# Altium schematic sheet LEDS_SWITCHS.SchDoc
size A; SheetNumber: 3; SheetTotal: 6
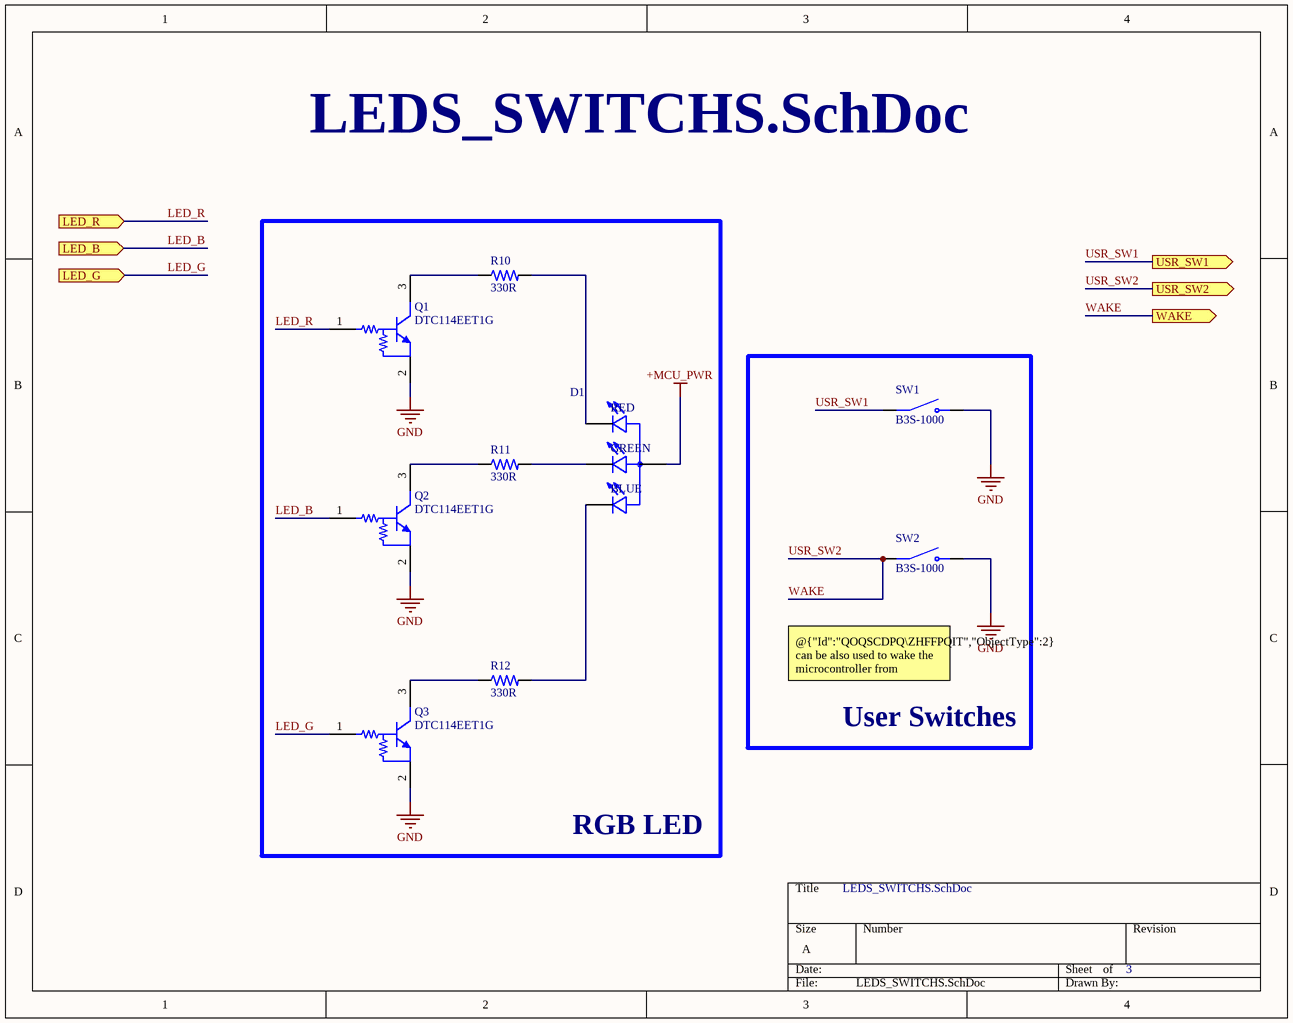
[diagram p0: LEDS_SWITCHS.SchDoc]

## Parts
D1  CLMVC-FKA-CL1D1L71BB7C3C3  [LED_CLMVC-FKA-CL1D1L71BB7C3C3]  (value not drawn)
Q1  DTC114EET1G  [ONSC-SC-75-3-463-01_V]
Q2  DTC114EET1G  [ONSC-SC-75-3-463-01_V]
Q3  DTC114EET1G  [ONSC-SC-75-3-463-01_V]
R10  330R  [0402 RES]
R11  330R  [0402 RES]
R12  330R  [0402 RES]
SW1  B3S-1000  [SW_B3S-1000]
SW2  B3S-1000  [SW_B3S-1000]

## Blocks framed on the sheet
RGB LED: D1 Q1-Q3 R10-R12
User Switches: SW1 SW2

## Ports
LED_B (in, see Master[1B], Main_MCU[4C]), LED_G (in, see Master[1B], Main_MCU[4C]), LED_R (in, see Master[1B], Main_MCU[4C]), USR_SW1 (out, see Master[1C], Main_MCU[4C]), USR_SW2 (out, see Master[1C], Main_MCU[4C]), WAKE (out, see Master[1C], Powering[1A])

## Nets
+MCU_PWR: D1.1(A)
GND: Q1.2(E) Q2.2(E) Q3.2(E) SW1.4(NO) SW2.4(NO)
LED_B: Q2.1(B) ; port LED_B
LED_G: Q3.1(B) ; port LED_G
LED_R: Q1.1(B) ; port LED_R
USR_SW1: SW1.2(COM) ; port USR_SW1
USR_SW2: SW2.2(COM) ; port USR_SW2, port WAKE  [also labelled WAKE]
NetD1_2: D1.2(B_C) R12.2
NetD1_3: D1.3(G_C) R11.2
NetD1_4: D1.4(R_C) R10.2
NetQ1_3: Q1.3(C) R10.1
NetQ2_3: Q2.3(C) R11.1
NetQ3_3: Q3.3(C) R12.1

## Notes on the sheet
- @{"Id":"QOQSCDPQ\ZHFFPQIT","ObjectType":2} can be also used to wake the microcontroller from hibernate mode
- (in symbol CLMVC-FKA-CL1D1L71BB7C3C3) RED; GREEN; BLUE

## Library data of the parts
D1 = CLMVC-FKA-CL1D1L71BB7C3C3: MF: {'manufacturer': u'CreeLED, Inc.'}; Package: None; Price: None; Value: *; MP: CLMVC-FKA-CL1D1L71BB7C3C3; Availability: Unavailable
Q1-Q3 = CMP-0630-00210-1: Digital Transistor (BRT), R1=10 kOhm, R2=10 kOhm, NPN Transistor, 3-Pin SC-75, Pb-Free, Tape and Reel; Manufacturer: On Semiconductor; IC Continuous (A): 0.1; hFE Min: 35; V(BR)CEO Min (V): 50; R1/R2 Typ: 1; Mounting Technology: Surface Mount; RoHS: TRUE; Packing: Tape and Reel; DatasheetVersion: Rev. 5; ComponentLink1Description: Manufacturer URL; ComponentLink3Description: Package Specification; PartNumber: DTC114EET1G; PackageReference: SC-75-3-463-01; PackageVersion: Rev. F, 07/2005; ComponentLink1URL: http://www.onsemi.com/; Polarity: NPN; ComponentLink3URL: http://www.onsemi.com/pub_link/Collateral/463-01.PDF; ComponentLink2Description: Datasheet; PackageDescription: 3-Pin Small Outline Transistor, Body 1.6 x 0.8 mm, Pitch 0.5 mm; ComponentLink2URL: http://www.onsemi.cn/pub_link/Collateral/DTC114E-D.PDF
R10-R12 = 0402 SMD Resistor: Fixed Resistor, Metal Glaze/thick Film, 0.125W, 330ohm, 75V, 1% +/-Tol, 100ppm/Cel, Surface Mount, 0402; Manufacturer: Vishay Dale; Manufacturer Part Number: RCC0402330RFKED; ComponentLink1Description: Link; ComponentLink1URL: *; Supplier: Digikey; Supplier Part Number: 541-RCC0402330RFKEDCT-ND; RoHS: Yes; Category: Chip SMD Resistors; Stock: 92625; Pricing: 1=0.1, 10=0.046, 50=0.0296, 100=0.0248, 500=0.01724, 1000=0.01499, 5000=0.0113 (USD)
SW1 SW2 = B3S-1000: Tactile Switch SPST-NO Top Actuated Surface Mount; pin to pad: 2>1+2 4>3+4; MF: Omron; Availability: Unavailable; Value: *; Package: None; Price: None; MP: B3S-1000; SnapEDA_Link: https://www.snapeda.com/parts/B3S-1000/Omron%20Electronics%20Inc-EMC%20Div/view-part/47351/?ref=snap